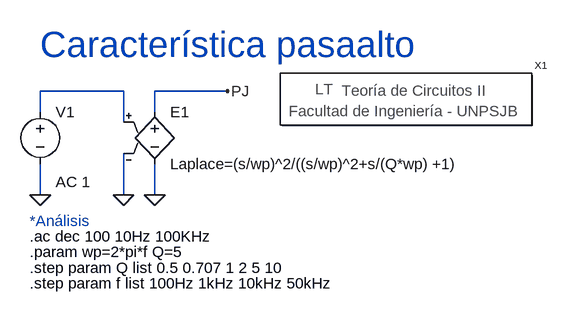
[diagram p0: schematic característicafiltropasaalto.asc]
característicafiltropasaalto.asc, the LTspice schematic file:
Version 4
SHEET 1 880 680
WIRE -64 80 -192 80
WIRE 96 80 -16 80
WIRE -192 112 -192 80
WIRE -16 112 -16 80
WIRE -64 128 -64 80
WIRE -192 240 -192 192
WIRE -64 240 -64 176
WIRE -16 240 -16 192
FLAG 96 80 PJ
FLAG -16 240 0
FLAG -64 240 0
FLAG -192 240 0
SYMBOL voltage -192 96 R0
WINDOW 123 24 124 Left 2
WINDOW 39 0 0 Left 0
SYMATTR InstName V1
SYMATTR Value ""
SYMATTR Value2 AC 1
SYMBOL e -16 96 R0
SYMATTR InstName E1
SYMATTR Value Laplace=(s/wp)^2/((s/wp)^2+s/(Q*wp) +1)
SYMBOL Circuitos2\\Letreros\\Teoría\ de\ Circuitos\ II 368 96 R0
SYMATTR InstName X1
TEXT -208 280 Left 2 ;*Análisis
TEXT -208 304 Left 2 !.ac dec 100 10Hz 100KHz
TEXT -208 328 Left 2 !.param wp=2*pi*f Q=5
TEXT -208 352 Left 2 !.step param Q list 0.5 0.707 1 2 5 10
TEXT -208 376 Left 2 !.step param f list 100Hz 1kHz 10kHz 50kHz
TEXT -192 8 Left 5 ;Característica pasaalto

The netlist it stands for:
* característicafiltropasaalto.asc
V1 N001 0 AC 1
E1 PJ 0 N001 0 Laplace=(s/wp)^2/((s/wp)^2+s/(Q*wp) +1)
XX1 Teoría de Circuitos II
* *Análisis
.ac dec 100 10Hz 100KHz
.param wp=2*pi*f Q=5
.step param Q list 0.5 0.707 1 2 5 10
.step param f list 100Hz 1kHz 10kHz 50kHz
* Característica pasaalto
.backanno
.end